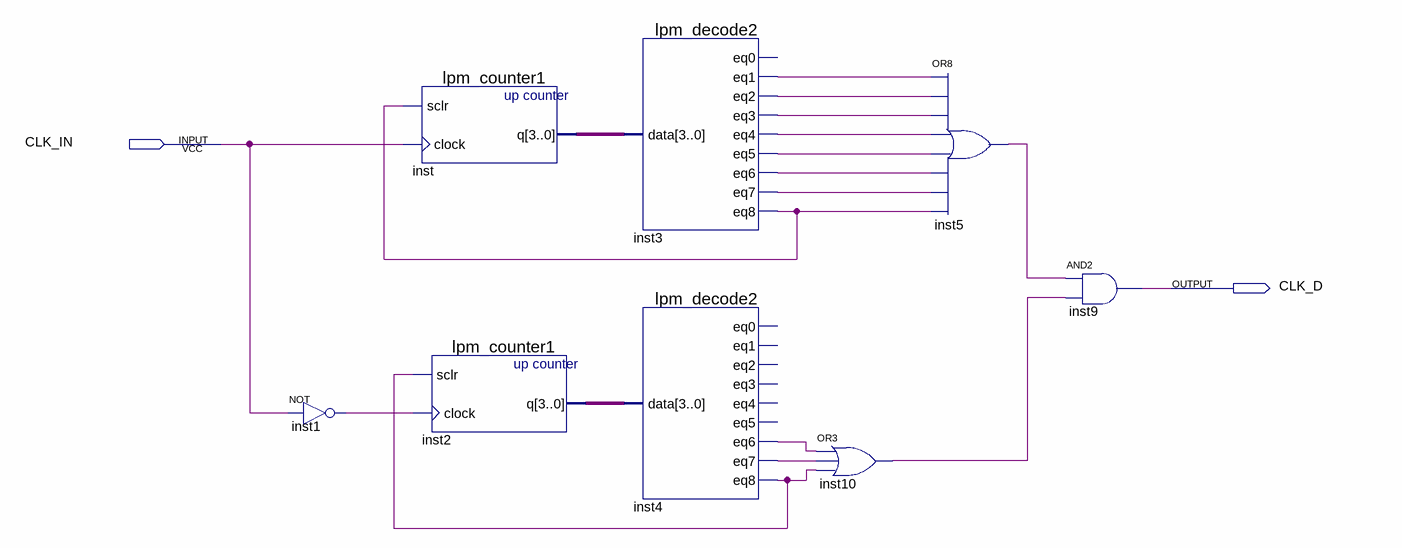
[diagram p0: schematic sheet]
// Quartus schematic lab2block2.bdf as structural Verilog: 8 symbols, 2 pins
module lab2block2 (
  input  CLK_IN,
  output CLK_D
);

  wire inst1_out, inst3_eq1, inst3_eq2, inst3_eq3, inst3_eq4, inst3_eq5, inst3_eq6, inst3_eq7, inst3_eq8,
       inst4_eq6, inst4_eq7, inst4_eq8, inst5_out, inst10_out;
  wire [3:0] inst2_q, inst_q;

  not inst1 (inst1_out, CLK_IN);
  lpm_counter1 inst (.sclr(inst3_eq8), .clock(CLK_IN), .q(inst_q));
  lpm_counter1 inst2 (.sclr(inst4_eq8), .clock(inst1_out), .q(inst2_q));
  lpm_decode2 inst3 (
    .data(inst_q), .eq1(inst3_eq1), .eq2(inst3_eq2), .eq3(inst3_eq3), .eq4(inst3_eq4), .eq5(inst3_eq5),
    .eq6(inst3_eq6), .eq7(inst3_eq7), .eq8(inst3_eq8));  // open: eq0
  lpm_decode2 inst4 (
    .data(inst2_q), .eq6(inst4_eq6), .eq7(inst4_eq7), .eq8(inst4_eq8));  // open: eq0, eq1, eq2, eq3, eq4, eq5
  or inst10 (inst10_out, inst4_eq6, inst4_eq7, inst4_eq8);
  or inst5 (inst5_out, inst3_eq1, inst3_eq2, inst3_eq3, inst3_eq4, inst3_eq5, inst3_eq6, inst3_eq7, inst3_eq8);
  and inst9 (CLK_D, inst5_out, inst10_out);
endmodule
